# Altium schematic sheet USB Control Unit.SchDoc: USB Control Unit
size A3; DrawnBy: Adrien Dos SANTOS; Organization: Altium Limited; Revision: REV 1.0; SheetNumber: 5; SheetTotal: 5; ProjectName: projname
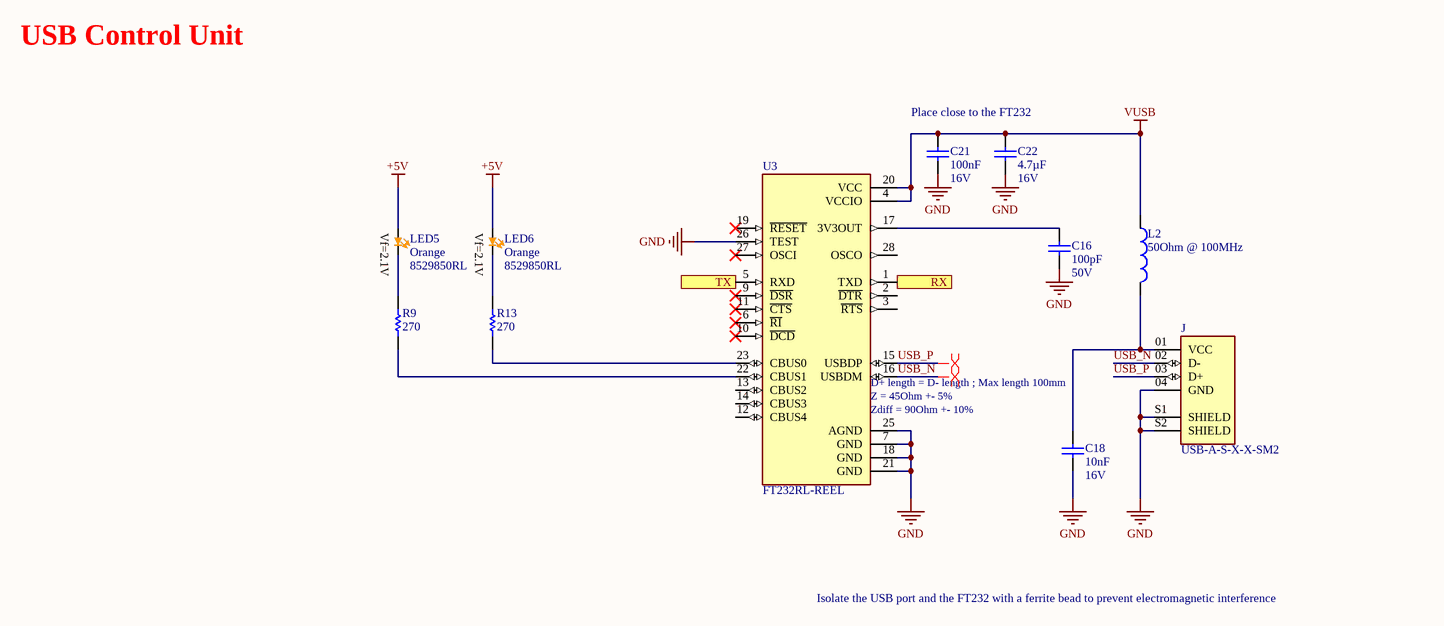
[diagram p0: USB Control Unit.SchDoc]

## Parts
C16  value 100pF  Voltage - Rated: 50V  [CC0201 x 0.33mm]  (hidden comment: CAP)
C18  value 10nF  Voltage - Rated: 16V  [CC0603 x 0.95mm]  (hidden comment: CAP)
C21  value 100nF  Voltage - Rated: 16V  [CC0603 x 0.90mm]  (hidden comment: CAP)
C22  value 4.7µF  Voltage - Rated: 16V  [CC0603 x 0.95mm]  (hidden comment: CAP)
J  USB-A-S-X-X-SM2  [SAMTEC_USB-A-S-X-X-SM2]
L2  50Ohm @ 100MHz  [MMZ1608D500CTDH5]
LED5  Orange  Supplier Part Number 1: 8529850RL  [LED 0603 ORANGE]
LED6  Orange  Supplier Part Number 1: 8529850RL  [LED 0603 ORANGE]
R9  value 270  [RESC0603_N]  (hidden comment: RES)
R13  value 270  [RESC0603_N]  (hidden comment: RES)
U3  FT232RL-REEL  [SOP65P780X200-28N]

## Ports
RX (out), TX (in)

## Nets
+5V: LED5.2(A) LED6.2(A)
GND: C16.1 C18.1 C21.1 C22.1 J.04(GND) J.S1(SHIELD) J.S2(SHIELD) U3.7(GND) U3.18(GND) U3.21(GND) U3.25(AGND) U3.26(TEST)
VUSB: C21.2 C22.2 L2.1 U3.4(VCCIO) U3.20(VCC)
RX: U3.1(TXD) ; port RX
TX: U3.5(RXD) ; port TX
USB_N: J.02(D-) U3.16(USBDM)
USB_P: J.03(D+) U3.15(USBDP)
NetC16_2: C16.2 U3.17(3V3OUT)
NetC18_2: C18.2 J.01(VCC) L2.2
NetLED5_1: LED5.1(K) R9.2
NetLED6_1: LED6.1(K) R13.2
NetR9_1: R9.1 U3.22(CBUS1)
NetR13_1: R13.1 U3.23(CBUS0)

Not connected (* = marked no-connect by the designer): U3 2(~{DTR}) 3(~{RTS}) 6(~{RI})* 9(~{DSR})* 10(~{DCD})* 11(~{CTS})* 12(CBUS4) 13(CBUS2) 14(CBUS3) 19(~{RESET})* 27(OSCI)* 28(OSCO)

## Layout directives
differential pair; differential pair class USB: USB_N, USB_P

## Notes on the sheet
- USB Control Unit
- Place close to the FT232
- (near U3) D+ length = D- length ; Max length 100mm
- (near U3) Z = 45Ohm +- 5%
- (near U3) Zdiff = 90Ohm +- 10%
- Isolate the USB port and the FT232 with a ferrite bead to prevent electromagnetic interference
- Title
- Size:
- Date:
- A3
- Revision:
- Time:
- Sheet
- of
- Avnet EMG France SA
- 12 rue Jean Bart
- 91120 MASSY - FR
- File:
- Drawn by :
- (in symbol KP-1608SECK) Vf=2.1V

## Library data of the parts
C16 = GRM0335C1H101GA01D: 100pF ±2% 50V Ceramic Capacitor C0G, NP0 0201 (0603 Metric); manufacturer: Murata Electronics; Manufacturer Standard Lead Time: 11 Weeks; currency: USD; idx: 118; Package Inch: 0201; Package Metric: 0603; Normalized value µF: 0.0001; Part Number: GRM0335C1H101GA01D; price: *; Rated Voltage: *; Tolerance: ±2%; Temperature Coefficient: C0G, NP0; MOQ: *; ComponentLink1URL: https://search.murata.co.jp/Ceramy/image/img/A01X/G101/ENG/GRM0335C1H101GA01-01.pdf; ProductLink: https://www.digikey.com/product-detail/en/murata-electronics/GRM0335C1H101GA01D/490-7751-2-ND/4358135; Digi-Key Part Number: 490-7751-2-ND; Operating Temperature: -55°C ~ 125°C; Lead Free Status / RoHS Status: Lead free / ROHS3 Compliant; Mounting Type: Surface Mount, MLCC; Size / Dimension: 0.024" L x 0.012" W (0.60mm x 0.30mm); Thickness (Max): 0.013" (0.33mm); Thickness mm: 0.33; Thickness Inch: 0.013; Length Inch: 0.024; Width Inch: 0.012; Length mm: 0.60; Width mm: 0.30; Series: GRM; Part Status: Active; Package / Case: 0201 (0603 Metric); Lead Style: -; Packaging: Tape & Reel (TR); Moisture Sensitivity Level (MSL): 1  (Unlimited); ComponentLink1Description: Datasheet; Applications: General Purpose; Height - Seated (Max): -; Lead Spacing: -; Capacitance: 100pF; Features: -; Ratings: -
C18 = CS0603KRX7R7BB103: 10000pF ±10% 16V Ceramic Capacitor X7R 0603 (1608 Metric); manufacturer: Yageo; Manufacturer Standard Lead Time: 17 Weeks; currency: USD; idx: 48811; Package Inch: 0603; Package Metric: 1608; Normalized value µF: 0.01; Part Number: CS0603KRX7R7BB103; price: *; Rated Voltage: *; Tolerance: ±10%; Temperature Coefficient: X7R; MOQ: *; ComponentLink1URL: http://www.yageo.com/NewPortal/yageodocoutput?fileName=/pdf/MLCC/UPY-ST_NPOX7R_16V-to-3KV_5.pdf; ProductLink: https://www.digikey.com/product-detail/en/yageo/CS0603KRX7R7BB103/CS0603KRX7R7BB103-ND/6097905; Digi-Key Part Number: CS0603KRX7R7BB103-ND; Operating Temperature: -55°C ~ 125°C; Lead Free Status / RoHS Status: Lead free / ROHS3 Compliant; Mounting Type: Surface Mount, MLCC; Size / Dimension: 0.063" L x 0.031" W (1.60mm x 0.80mm); Thickness (Max): 0.037" (0.95mm); Thickness mm: 0.95; Thickness Inch: 0.037; Length Inch: 0.063; Width Inch: 0.031; Length mm: 1.60; Width mm: 0.80; Series: CS; Part Status: Active; Package / Case: 0603 (1608 Metric); Lead Style: -; Packaging: Tape & Reel (TR); Moisture Sensitivity Level (MSL): 1  (Unlimited); Applications: Boardflex Sensitive; Height - Seated (Max): -; Lead Spacing: -; Capacitance: 10000pF; Features: Soft Termination; Ratings: -; Failure Rate: -
C21 = CC0603KRX7R7BB104: 0.1µF ±10% 16V Ceramic Capacitor X7R 0603 (1608 Metric); manufacturer: Yageo; Manufacturer Standard Lead Time: 16 Weeks; currency: USD; idx: 766; Package Inch: 0603; Package Metric: 1608; Normalized value µF: 0.1; Part Number: CC0603KRX7R7BB104; price: *; Rated Voltage: *; Tolerance: ±10%; Temperature Coefficient: X7R; MOQ: *; ComponentLink1URL: https://www.yageo.com/upload/media/product/productsearch/datasheet/mlcc/UPY-GPHC_X7R_6.3V-to-50V_18.pdf; ProductLink: https://www.digikey.com/product-detail/en/yageo/CC0603KRX7R7BB104/311-1088-2-ND/302822; Digi-Key Part Number: 311-1088-2-ND; Operating Temperature: -55°C ~ 125°C; Lead Free Status / RoHS Status: Lead free / ROHS3 Compliant; Mounting Type: Surface Mount, MLCC; Size / Dimension: 0.063" L x 0.031" W (1.60mm x 0.80mm); Thickness (Max): 0.035" (0.90mm); Thickness mm: 0.90; Thickness Inch: 0.035; Length Inch: 0.063; Width Inch: 0.031; Length mm: 1.60; Width mm: 0.80; Series: CC; Part Status: Active; Package / Case: 0603 (1608 Metric); Lead Style: -; Packaging: Tape & Reel (TR); Moisture Sensitivity Level (MSL): 1  (Unlimited); Applications: General Purpose; Height - Seated (Max): -; Lead Spacing: -; Capacitance: 0.1µF; Features: -; Ratings: -; Failure Rate: -
C22 = CC0603KRX5R7BB475: 4.7µF ±10% 16V Ceramic Capacitor X5R 0603 (1608 Metric); manufacturer: Yageo; currency: USD; idx: 4886; Package Inch: 0603; Package Metric: 1608; Normalized value µF: 4.7; Part Number: CC0603KRX5R7BB475; price: *; Rated Voltage: *; Tolerance: ±10%; Temperature Coefficient: X5R; MOQ: *; ComponentLink1URL: https://www.yageo.com/upload/media/product/productsearch/datasheet/mlcc/UPY-GPHC_X5R_4V-to-50V_25.pdf; ProductLink: https://www.digikey.com/product-detail/en/yageo/CC0603KRX5R7BB475/311-1785-2-ND/5195193; Digi-Key Part Number: 311-1785-2-ND; Operating Temperature: -55°C ~ 85°C; Lead Free Status / RoHS Status: Lead free / ROHS3 Compliant; Mounting Type: Surface Mount, MLCC; Size / Dimension: 0.063" L x 0.031" W (1.60mm x 0.80mm); Thickness (Max): 0.037" (0.95mm); Thickness mm: 0.95; Thickness Inch: 0.037; Length Inch: 0.063; Width Inch: 0.031; Length mm: 1.60; Width mm: 0.80; Series: CC; Part Status: Active; Package / Case: 0603 (1608 Metric); Lead Style: -; Packaging: Tape & Reel (TR); Moisture Sensitivity Level (MSL): 1  (Unlimited); Applications: General Purpose; Height - Seated (Max): -; Lead Spacing: -; Capacitance: 4.7µF; Features: -; Ratings: -; Failure Rate: -
J = USB-A-S-X-X-SM2: USB-A (USB TYPE-A) USB 2.0 Receptacle Connector 4 Position Surface Mount, Right Angle; MP: USB-A-S-F-B-SM2; MF: Samtec; SnapEDA_Link: https://www.snapeda.com/parts/USB-A-S-F-B-SM2/Samtec%20Inc./view-part/937545/?ref=snap; Value: *; Availability: Unavailable; DigiKey-Purchase-URL: https://snapeda.com/shop?store=DigiKey&id=937545; Package: None; Toby_UK-Purchase-URL: https://snapeda.com/shop?store=Toby+UK&id=937545; Price: None
L2 = MMZ1608D500CTDH5
LED5 LED6 = KP-1608SECK: 1.6 mm x 0.8 mm Orange SMD Top LED; Manufacturer: Kingbright; currency: EUR; Lens Colour: Clear; Viewing Angle: 120°; Lens Style: Diffused,Colorless,Rectangular; Wavelength: 601nm; Luminous Intensity: 250mcd; Forward Voltage: 2.1V; Forward Current: 30mA; Number of LEDs: 1; Power Dissipation: 75mW; Avnet Part Number: KINKPG1608SEKCT; Price: 0.0296; MOQ: 2000; ComponentLink1URL: https://datasheet.ciiva.com/8060/1655842-8060422.pdf; ComponentLink1Description: https://datasheet.ciiva.com/8060/1655842-8060422.pdf; ComponentLink2URL: https://datasheet.ciiva.com/41454/001050379-da-01-en-smd-chipled-bl-0603-kp-1608qbc-d-41454603.pdf; ComponentLink2Description: https://datasheet.ciiva.com/41454/001050379-da-01-en-smd-chipled-bl-0603-kp-1608qbc-d-41454603.pdf; Supplier 1: Element14; Part Number: KP-1608SECK; Stock 1: 0; Case/Package: 1608; Number of Pins: 2; Colour: Orange; Packaging: Cut Tape; Dominant Wavelength: 601nm; Length: 0.8mm; Height: 1.1mm; Width: 1.6mm; Radiation Hardening: No; REACH SVHC: No SVHC; ComponentLink3URL: https://datasheet.ciiva.com/8060/1701685-8060423.pdf; ComponentLink3Description: https://datasheet.ciiva.com/8060/1701685-8060423.pdf; ComponentLink4URL: https://datasheet.ciiva.com/20166/72-4726-20166919.pdf; ComponentLink4Description: https://datasheet.ciiva.com/20166/72-4726-20166919.pdf; ComponentLink5URL: https://datasheet.ciiva.com/20166/72-4730-20166961.pdf; ComponentLink5Description: https://datasheet.ciiva.com/20166/72-4730-20166961.pdf; ComponentLink6URL: https://datasheet.ciiva.com/8060/1701685-8060424.pdf; ComponentLink6Description: https://datasheet.ciiva.com/8060/1701685-8060424.pdf; ComponentLink7URL: https://datasheet.ciiva.com/46397/1701685-46397813.pdf; ComponentLink7Description: https://datasheet.ciiva.com/46397/1701685-46397813.pdf
R9 R13 = RT0603BRE07270RL: RES 270 OHM 1/10W .1% SMD 0603; manufacturer: Yageo; currency: USD; Rated Power: 0.1W, 1/10W; smt_res_0603id: 163901; sub_category_id: 619; category_id: 33; Temperature Coefficient: ±50ppm/°C; Tolerance: ±0.1%; lead_style: Surface Mount (SMD - SMT); Value Unit: 1; MOQ: 5.000; Part Number: RT0603BRE07270RL; price: 0.11300; image: http://media.digikey.com/Renders/Yageo%20Renders/RC0603FR-0710RL_tmb.jpg; Digikey PN: RT0603BRE07270RL-ND; series: RT; composition: Thin Film; features: -; Case: 0603 (1608 metric); Size Dimension: 0.063" L x 0.031" W (1.60mm x 0.80mm); Height: 0.018" (0.45mm); packaging: Tape & Reel (TR); quantity_available: 0; datasheet: http://www.yageo.com/pdf/PYu-RT_1-to-0.05_RoHS_L_3.pdf; Normalized Value: 270; Display Value: 270; Value_in_ohm: 270
U3 = FT232RL-REEL: USB Bridge, USB to UART USB 2.0 UART Interface 28-SSOP; MF: FTDI,; MP: FT232RL-REEL; Package: SSOP-28 FTDI; SnapEDA_Link: https://www.snapeda.com/parts/FT232RL-REEL/FTDI,%20Future%20Technology%20Devices%20International%20Ltd/view-part/45427/?ref=snap; Value: *; Check_prices: https://www.snapeda.com/parts/FT232RL-REEL/FTDI,%20Future%20Technology%20Devices%20International%20Ltd/view-part/45427/?ref=eda; Purchase-URL: https://pricing.snapeda.com/search/part/FT232RL-REEL/?ref=eda; Digi-Key_Part_Number: 768-1007-1-ND